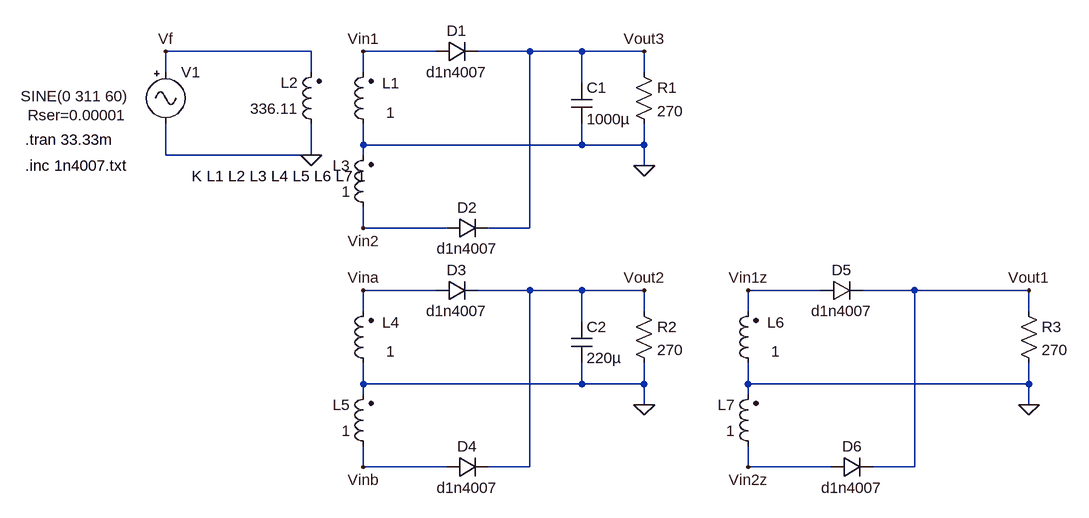
[diagram p0: schematic retificador onda completa com ponto medio.asc]
retificador onda completa com ponto medio.asc, the LTspice schematic file:
Version 4
SHEET 1 884 832
WIRE -288 144 -512 144
WIRE -96 144 -208 144
WIRE 48 144 -32 144
WIRE 128 144 48 144
WIRE 224 144 128 144
WIRE -512 176 -512 144
WIRE -288 176 -288 144
WIRE -208 176 -208 144
WIRE 224 176 224 144
WIRE 128 192 128 144
WIRE -208 288 -208 256
WIRE 128 288 128 256
WIRE 128 288 -208 288
WIRE 224 288 224 256
WIRE 224 288 128 288
WIRE -512 304 -512 256
WIRE -288 304 -288 256
WIRE -288 304 -512 304
WIRE -208 304 -208 288
WIRE 224 320 224 288
WIRE -208 416 -208 384
WIRE -80 416 -208 416
WIRE 48 416 48 144
WIRE 48 416 -16 416
WIRE -96 512 -208 512
WIRE 48 512 -32 512
WIRE 128 512 48 512
WIRE 224 512 128 512
WIRE 496 512 384 512
WIRE 640 512 560 512
WIRE 816 512 640 512
WIRE -208 544 -208 512
WIRE 224 544 224 512
WIRE 384 544 384 512
WIRE 816 544 816 512
WIRE 128 560 128 512
WIRE -208 656 -208 624
WIRE 128 656 128 624
WIRE 128 656 -208 656
WIRE 224 656 224 624
WIRE 224 656 128 656
WIRE 384 656 384 624
WIRE 816 656 816 624
WIRE 816 656 384 656
WIRE -208 672 -208 656
WIRE 384 672 384 656
WIRE 224 688 224 656
WIRE 816 688 816 656
WIRE -208 784 -208 752
WIRE -80 784 -208 784
WIRE 48 784 48 512
WIRE 48 784 -16 784
WIRE 384 784 384 752
WIRE 512 784 384 784
WIRE 640 784 640 512
WIRE 640 784 576 784
FLAG -512 144 Vf
FLAG 224 320 0
FLAG -208 144 Vin1
FLAG 224 144 Vout3
FLAG -208 416 Vin2
FLAG -288 304 0
FLAG 224 688 0
FLAG -208 512 Vina
FLAG 224 512 Vout2
FLAG -208 784 Vinb
FLAG 816 688 0
FLAG 384 512 Vin1z
FLAG 816 512 Vout1
FLAG 384 784 Vin2z
SYMBOL diode -96 160 R270
WINDOW 0 32 32 VTop 2
WINDOW 3 0 32 VBottom 2
SYMATTR InstName D1
SYMATTR Value d1n4007
SYMBOL res 208 160 R0
SYMATTR InstName R1
SYMATTR Value 270
SYMBOL ind2 -192 272 R180
WINDOW 0 -40 79 Left 2
WINDOW 3 -33 34 Left 2
SYMATTR InstName L1
SYMATTR Value 1
SYMATTR Type ind
SYMBOL diode -80 432 R270
WINDOW 0 32 32 VTop 2
WINDOW 3 0 32 VBottom 2
SYMATTR InstName D2
SYMATTR Value d1n4007
SYMBOL Misc\\signal -512 160 R0
WINDOW 123 0 0 Left 0
WINDOW 39 -212 82 Left 2
WINDOW 3 -223 53 Left 2
SYMATTR SpiceLine Rser=0.00001
SYMATTR Value SINE(0 311 60)
SYMATTR InstName V1
SYMBOL ind2 -272 272 R180
WINDOW 0 36 80 Left 2
WINDOW 3 36 40 Left 2
SYMATTR InstName L2
SYMATTR Value 336.11
SYMATTR Type ind
SYMBOL ind2 -192 400 R180
WINDOW 0 36 80 Left 2
WINDOW 3 36 40 Left 2
SYMATTR InstName L3
SYMATTR Value 1
SYMATTR Type ind
SYMBOL cap 112 192 R0
SYMATTR InstName C1
SYMATTR Value 1000µ
SYMBOL diode -96 528 R270
WINDOW 0 32 32 VTop 2
WINDOW 3 0 32 VBottom 2
SYMATTR InstName D3
SYMATTR Value d1n4007
SYMBOL res 208 528 R0
SYMATTR InstName R2
SYMATTR Value 270
SYMBOL ind2 -192 640 R180
WINDOW 0 -40 79 Left 2
WINDOW 3 -33 34 Left 2
SYMATTR InstName L4
SYMATTR Value 1
SYMATTR Type ind
SYMBOL diode -80 800 R270
WINDOW 0 32 32 VTop 2
WINDOW 3 0 32 VBottom 2
SYMATTR InstName D4
SYMATTR Value d1n4007
SYMBOL ind2 -192 768 R180
WINDOW 0 36 80 Left 2
WINDOW 3 36 40 Left 2
SYMATTR InstName L5
SYMATTR Value 1
SYMATTR Type ind
SYMBOL cap 112 560 R0
SYMATTR InstName C2
SYMATTR Value 220µ
SYMBOL diode 496 528 R270
WINDOW 0 32 32 VTop 2
WINDOW 3 0 32 VBottom 2
SYMATTR InstName D5
SYMATTR Value d1n4007
SYMBOL res 800 528 R0
SYMATTR InstName R3
SYMATTR Value 270
SYMBOL ind2 400 640 R180
WINDOW 0 -40 79 Left 2
WINDOW 3 -33 34 Left 2
SYMATTR InstName L6
SYMATTR Value 1
SYMATTR Type ind
SYMBOL diode 512 800 R270
WINDOW 0 32 32 VTop 2
WINDOW 3 0 32 VBottom 2
SYMATTR InstName D6
SYMATTR Value d1n4007
SYMBOL ind2 400 768 R180
WINDOW 0 36 80 Left 2
WINDOW 3 36 40 Left 2
SYMATTR InstName L7
SYMATTR Value 1
SYMATTR Type ind
TEXT -472 336 Left 2 !K L1 L2 L3 L4 L5 L6 L7 1
TEXT -728 280 Left 2 !.tran 33.33m
TEXT -728 320 Left 2 !.inc 1n4007.txt

The netlist it stands for:
* retificador onda completa com ponto medio.asc
D1 Vin1 Vout3 d1n4007
R1 Vout3 0 270
L1 0 Vin1 1
D2 Vin2 Vout3 d1n4007
V1 Vf 0 SINE(0 311 60) Rser=0.00001
L2 0 Vf 336.11
L3 Vin2 0 1
C1 Vout3 0 1000µ
D3 Vina Vout2 d1n4007
R2 Vout2 0 270
L4 0 Vina 1
D4 Vinb Vout2 d1n4007
L5 Vinb 0 1
C2 Vout2 0 220µ
D5 Vin1z Vout1 d1n4007
R3 Vout1 0 270
L6 0 Vin1z 1
D6 Vin2z Vout1 d1n4007
L7 Vin2z 0 1
.model D D
.lib standard.dio
K L1 L2 L3 L4 L5 L6 L7 1
.tran 33.33m
.inc 1n4007.txt
.backanno
.end